# EAGLE design rf24_uno-shield (EAGLE 6.5.0)
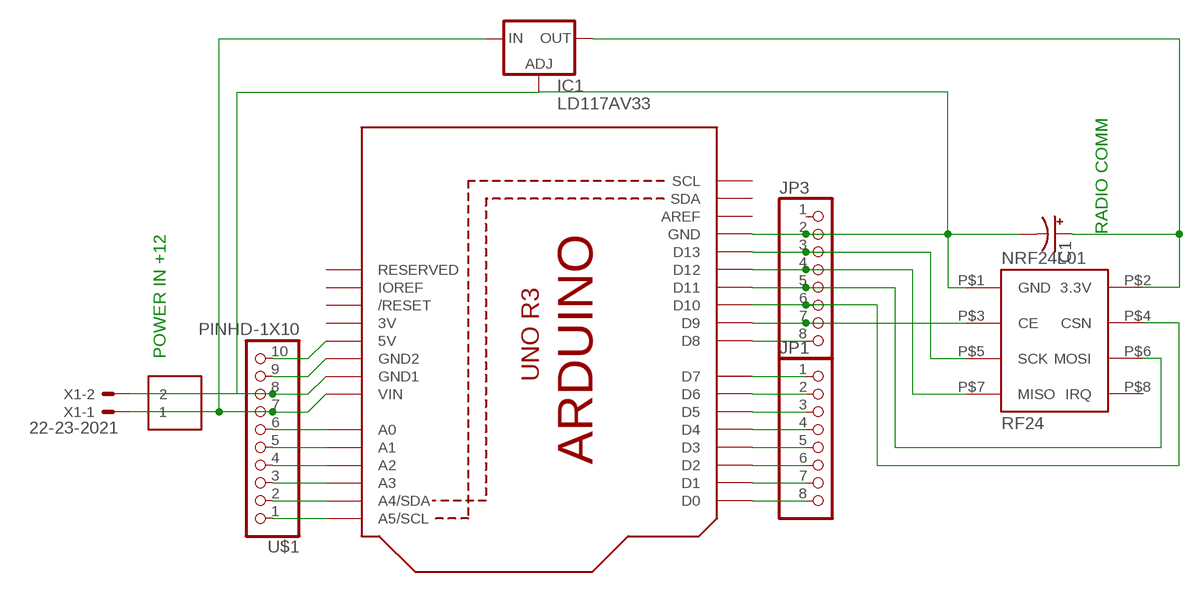
[diagram p0: schematic, sheet 1]

## Parts
+12V  1X2-3.5MM  [1X2-3.5MM]
C1  CPOL-USE2-5  [E2-5]
IC1  LD117AV33  [TO220L1]
JP1  PINHD-1X8BIG  [1X08-BIG]
JP3  PINHD-1X8BIG  [1X08-BIG]
NRF24L01  RF24  [4X2HEADER]
U1  ARDUINOR3-DIMENSION  [ARDUINOR3]
U$1  PINHD-1X10  [1X10-BIG]
X1  22-23-2021  [22-23-2021]

## Nets
N$1: U1.A0 U$1.6
N$2: C1.+ IC1.2(OUT) NRF24L01.P$2(3.3V)
N$3: +12V.2 C1.- IC1.1(ADJ) JP3.2 NRF24L01.P$1(GND) U1.GND U1.GND1 U$1.8 X1.2
N$4: JP3.3 NRF24L01.P$5(SCK) U1.D13
N$5: JP3.7 NRF24L01.P$3(CE) U1.D9
N$6: JP3.4 NRF24L01.P$7(MISO) U1.D12
N$7: JP3.5 NRF24L01.P$6(MOSI) U1.D11
N$8: JP3.6 NRF24L01.P$4(CSN) U1.D10
N$9: JP1.8 U1.D0
N$10: U1.A1 U$1.5
N$11: +12V.1 IC1.3(IN) U1.VIN U$1.7 X1.1
N$12: JP3.8 U1.D8
N$15: U1.GND2 U$1.9
N$16: U1.5V U$1.10
N$17: U1.A2 U$1.4
N$18: U1.A3 U$1.3
N$19: U1.A4(A4/SDA) U$1.2
N$20: U1.A5(A5/SCL) U$1.1
N$21: JP1.7 U1.D1
N$22: JP1.6 U1.D2
N$23: JP1.5 U1.D3
N$24: JP1.4 U1.D4
N$25: JP1.3 U1.D5
N$26: JP1.2 U1.D6
N$27: JP1.1 U1.D7
Unconnected: JP3.1 NRF24L01.P$8(IRQ) U1.AREF U1.IOREF U1.RESERVED U1.RESET(/RESET) U1.SCL U1.SDA

## Notes on the sheet
- RADIO COMM
- POWER IN +12

## Power pins joined to a net without a drawn wire
3V: U1.3V

## Library data of the parts
+12V = adafruit:1X2: 3.5mm Terminal block http://www.ladyada.net/library/pcb/eaglelibrary.html
C1 = adafruit:CPOL-US: POLARIZED CAPACITOR, American symbol
IC1 = v-reg:LD117A?*: Low drop fixed and adjustable positive voltage regulators 1 A Source: http://www.st.com/stonline/products/literature/ds/7194/ld1117axx.pdf
JP1 JP3 = adafruit:PINHD-1X8: PIN HEADER
NRF24L01 = rf24:RF24
U1 = adafruit:ARDUINOR3: This is a new object for the new Arduino R3 - with extra pins that you may want to use (such as IOref, and duplicated A4/A5
U$1 = adafruit:PINHD-1X10: Pin header 1x10 0.1" spacing With round pins
X1 = con-molex:22-23-2021: .100" (2.54mm) Center Header - 2 Pin; MF: MOLEX; MPN: 22-23-2021; OC_FARNELL: 1462926; OC_NEWARK: 25C3832

## Board
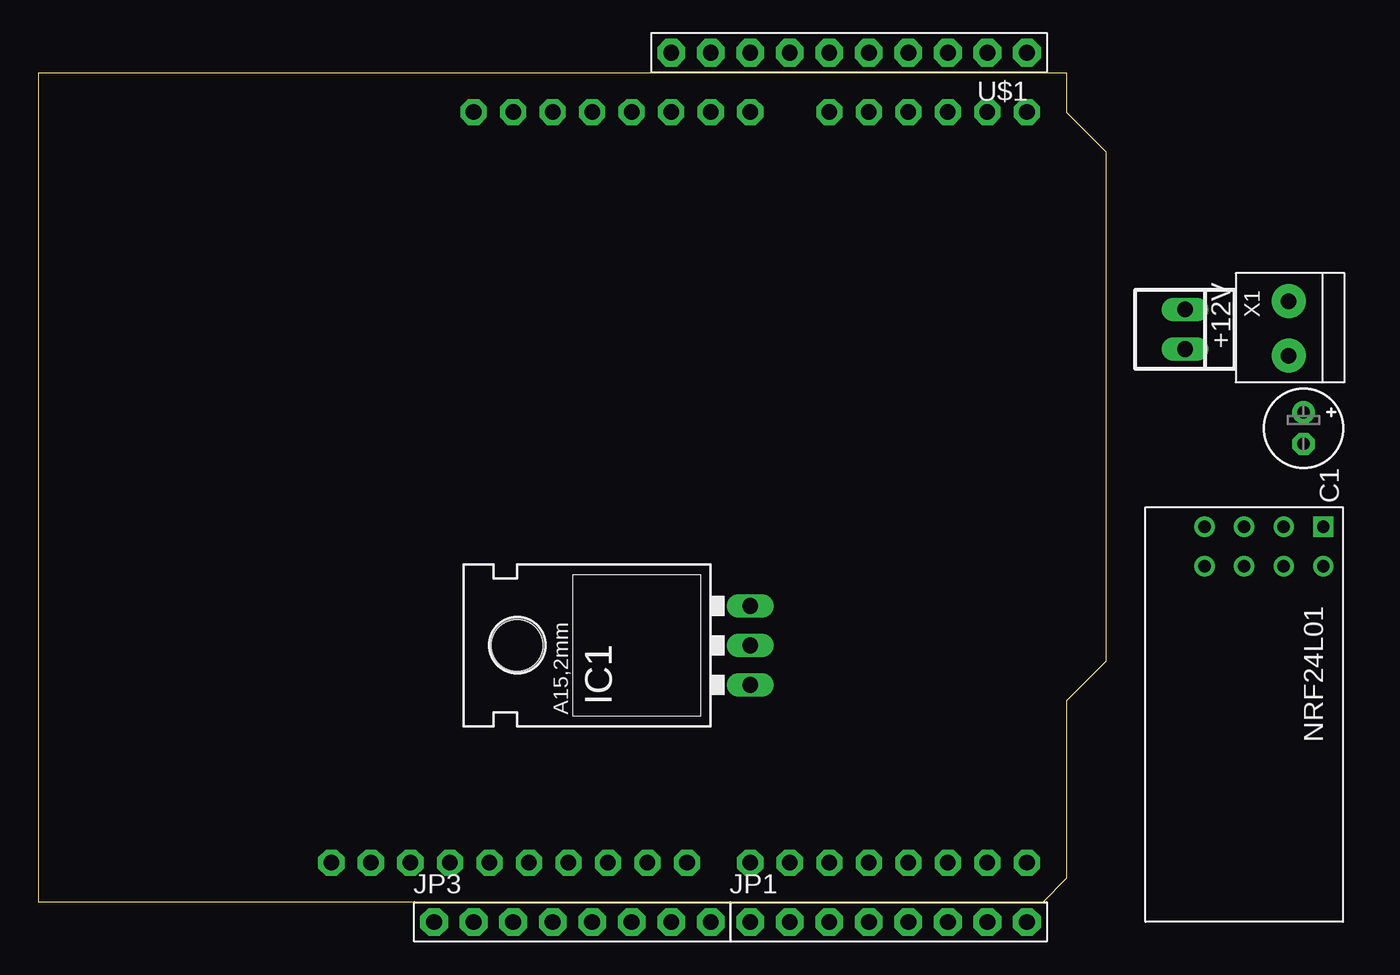
[diagram p1: board, top side]
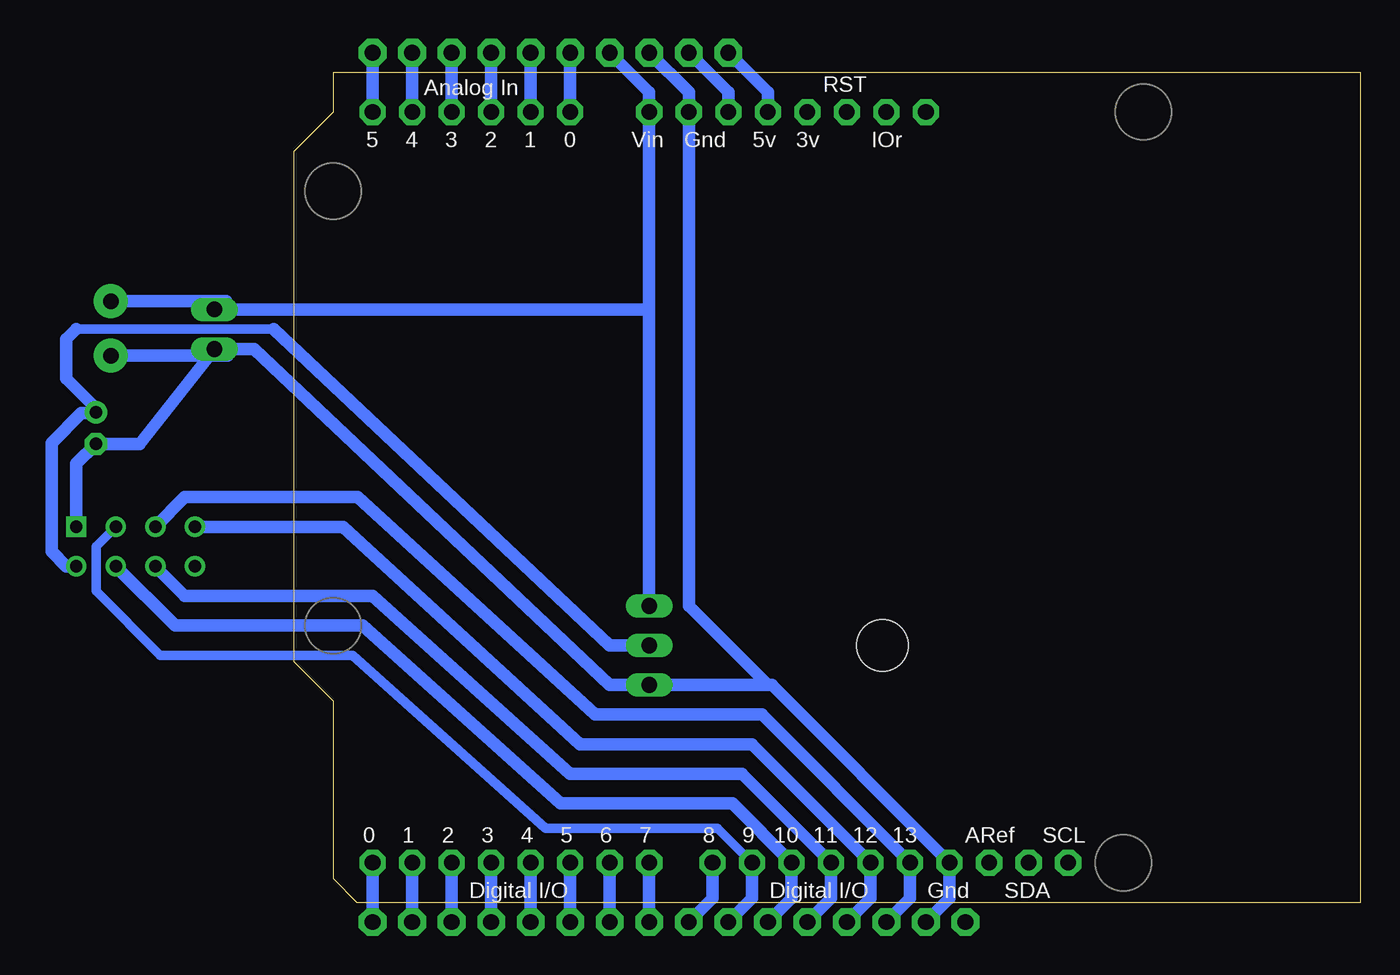
[diagram p2: board, bottom side, seen from below]

Size 68.58 x 53.34 mm. Coordinates in mm from the lower left corner, seen from the top.
Copper layers (1*16): Top 0.035mm / dielectric 1.5mm / Bottom 0.035mm
Design rules "default": minimum track width 10mil, minimum drill 24mil, track to track 8mil, track to pad 8mil, pad to pad 8mil, via to via 8mil, smd to smd 8mil, copper to edge 40mil, drill to drill 8mil, minimum pad ring 10mil, minimum via ring 8mil, stop-mask expansion 4mil, vias tented up to drill 0mil, thermal gap 10mil

### Footprints (pad centres in the part's own frame; a part is rotated, then mirrored left to right if it is on the bottom)
1X2-3.5MM = drill 1 pad 2.184: 1 1.8,0; 2 -1.7,0
E2-5 = drill 0.813 pad 1.422: + -1.016,0 | drill 0.813 pad 1.422 octagon: - 1.016,0
TO220L1 = drill 1.016 long: 1 -2.54,-3.81; 2 0,-3.81; 3 2.54,-3.81 | hole 3.302: 0,11.176
1X08-BIG = drill 1.016 pad 1.778 octagon: 1 -8.89,0; 2 -6.35,0; 3 -3.81,0; 4 -1.27,0; 5 1.27,0; 6 3.81,0; 7 6.35,0; 8 8.89,0
4X2HEADER = drill 0.8 square: P$1 -1.27,3.81 | drill 0.8: P$2 1.27,3.81; P$3 -1.27,1.27; P$4 1.27,1.27; P$5 -1.27,-1.27; P$6 1.27,-1.27; P$7 -1.27,-3.81; P$8 1.27,-3.81
ARDUINOR3 = drill 1 pad 1.676 octagon: 3V 35.56,2.54; 5V 38.1,2.54; A0 50.8,2.54; A1 53.34,2.54; A2 55.88,2.54; A3 58.42,2.54; A4 60.96,2.54; A5 63.5,2.54; AREF 23.876,50.8; D0 63.5,50.8; D1 60.96,50.8; D2 58.42,50.8; D3 55.88,50.8; D4 53.34,50.8; D5 50.8,50.8; D6 48.26,50.8; D7 45.72,50.8; D8 41.656,50.8; D9 39.116,50.8; D10 36.576,50.8; D11 34.036,50.8; D12 31.496,50.8; D13 28.956,50.8; GND 26.416,50.8; GND1 43.18,2.54; GND2 40.64,2.54; IOREF 30.48,2.54; RESERVED 27.94,2.54; RESET 33.02,2.54; SCL 18.796,50.8; SDA 21.336,50.8; VIN 45.72,2.54
1X10-BIG = drill 1.016 pad 1.778 octagon: 1 -11.43,0; 2 -8.89,0; 3 -6.35,0; 4 -3.81,0; 5 -1.27,0; 6 1.27,0; 7 3.81,0; 8 6.35,0; 9 8.89,0; 10 11.43,0
22-23-2021 = drill 1 long: 1 -1.27,0; 2 1.27,0

### Placement (x,y rotation side)
+12V  80.33,36.83 90 top  (outside the outline)
C1  81.28,30.48 270 top  (outside the outline)
IC1  41.91,16.51 90 top
JP1  54.61,-1.27 0 top
JP3  34.29,-1.27 0 top
NRF24L01  78.74,22.86 270 top  (outside the outline)
U1  0,53.34 180 bottom
U$1  52.07,54.61 180 top
X1  73.66,36.83 270 top  (outside the outline)

### Tracks (layer width: path | path; a pad name or v marks a point on that pad's centre or on a via)
N$1
  Bottom 0.813: U1.A0 U$1.6
N$2
  Bottom 0.406: 81.28,31.75 C1.+ 81.53,31.5
  Bottom 0.61: 69.85,36.83 82.55,36.83
  Bottom 0.813: IC1.2 48.26,16.51 69.85,36.83 | 82.55,36.83 83.19,36.2 83.19,33.66 81.28,31.75 | 81.53,31.5 81.6,31.43 82.23,31.43 84.14,29.53 84.14,22.54 83.19,21.59 NRF24L01.P$2
N$3
  Bottom 0.813: U$1.8 43.18,52.07 U1.GND1 43.18,19.05 38.1,13.97 | JP3.2 26.42,0.25 U1.GND 37.85,13.97 38.1,13.97 | 38.1,13.97 IC1.1 48.26,13.97 71.12,35.56 X1.2 | X1.2 72.82,35.13 +12V.2 | X1.2 78.49,29.46 C1.- 82.55,28.19 NRF24L01.P$1
N$4
  Bottom 0.813: JP3.3 28.96,0.25 U1.D13 38.48,12.07 49.21,12.07 64.45,26.04 75.56,26.04 NRF24L01.P$5
N$5
  Bottom 0.61: U1.D9 41.34,4.76 52.39,4.76 64.77,15.88 77.15,15.88 81.28,20 81.28,22.86 NRF24L01.P$3
  Bottom 0.813: U1.D9 39.12,0.25 JP3.7
N$6
  Bottom 0.813: JP3.4 31.5,0.25 U1.D12 39.12,10.16 50.17,10.16 65.41,24.13 NRF24L01.P$7
N$7
  Bottom 0.813: JP3.5 34.04,0.25 U1.D11 39.75,8.26 50.8,8.26 63.5,19.69 75.56,19.69 NRF24L01.P$6
N$8
  Bottom 0.813: JP3.6 36.58,0.25 U1.D10 40.39,6.35 51.44,6.35 64.14,17.78 76.2,17.78 NRF24L01.P$4
N$9
  Bottom 0.813: U1.D0 JP1.8
N$10
  Bottom 0.813: U1.A1 U$1.5
N$11
  Bottom 0.813: U$1.7 45.72,52.07 U1.VIN 45.72,38.1 | 45.72,38.1 IC1.3 | 45.72,38.1 X1.1 72.92,38.63 +12V.1
N$12
  Bottom 0.813: U1.D8 41.66,0.25 JP3.8
N$15
  Bottom 0.813: U1.GND2 40.64,52.07 U$1.9
N$16
  Bottom 0.813: U1.5V 38.1,52.07 U$1.10
N$17
  Bottom 0.813: U1.A2 U$1.4
N$18
  Bottom 0.813: U1.A3 U$1.3
N$19
  Bottom 0.813: U1.A4 U$1.2
N$20
  Bottom 0.813: U1.A5 U$1.1
N$21
  Bottom 0.813: U1.D1 JP1.7
N$22
  Bottom 0.813: U1.D2 JP1.6
N$23
  Bottom 0.813: U1.D3 JP1.5
N$24
  Bottom 0.813: U1.D4 JP1.4
N$25
  Bottom 0.813: U1.D5 JP1.3
N$26
  Bottom 0.813: U1.D6 JP1.2
N$27
  Bottom 0.813: U1.D7 JP1.1